# EAGLE design tomu-eagle1 (EAGLE 8.6.0)
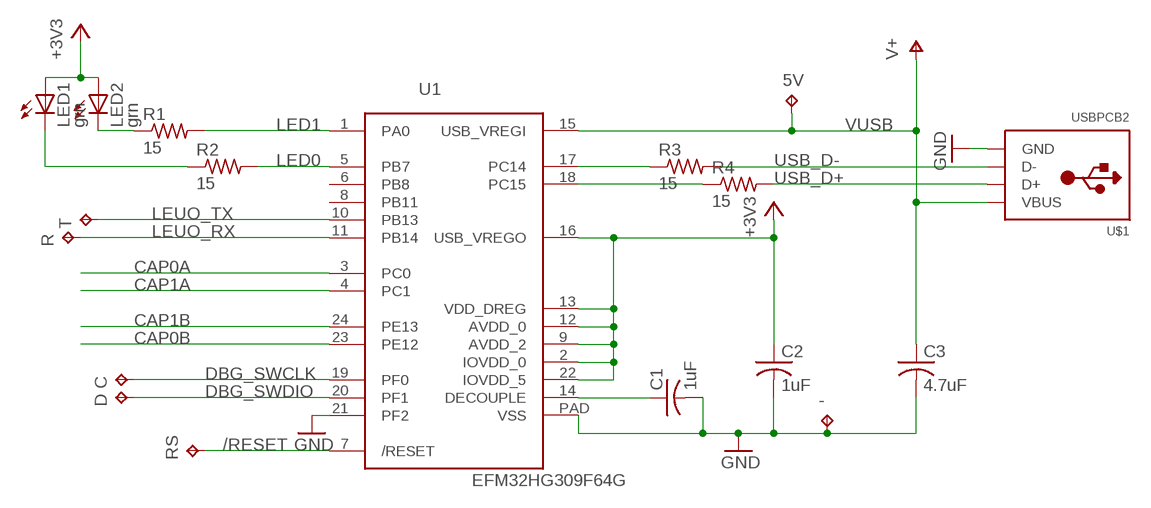
[diagram p0: schematic, sheet 1]

## Parts
5V  TPTP10R  [TP10R]
-  TPTP10SQ  [TP10SQ]
C  TPTP10R  [TP10R]
C1  1uF  C-USC0402  [C0402]
C2  1uF  C-USC0402  [C0402]
C3  4.7uF  C-USC0402  [C0402]
D  TPTP10R  [TP10R]
LED1  grn  LEDCHIP-LED0603  [CHIP-LED0603]
LED2  grn  LEDCHIP-LED0603  [CHIP-LED0603]
R  TPTP10R  [TP10R]
R1  15  R-US_R0402  [R0402]
R2  15  R-US_R0402  [R0402]
R3  15  R-US_R0402  [R0402]
R4  15  R-US_R0402  [R0402]
RS  TPTP10R  [TP10R]
T  TPTP10R  [TP10R]
U1  EFM32HG309F64G  [QFN24PAD]
U$1  USBPCB2  [USB-A-PCB-2]

## Nets
+3V3: C2.1 LED1.A LED2.A U1.2(IOVDD_0) U1.9(AVDD_2) U1.12(AVDD_0) U1.13(VDD_DREG) U1.16(USB_VREGO) U1.22(IOVDD_5)
/RESET: RS.TP U1.7(/RESET)
CAP0A: U1.3(PC0)
CAP0B: U1.23(PE12)
CAP1A: U1.4(PC1)
CAP1B: U1.24(PE13)
DBG_SWCLK: C.TP U1.19(PF0)
DBG_SWDIO: D.TP U1.20(PF1)
DECOUPLE: C1.1 U1.14(DECOUPLE)
GND: -.TP C1.2 C2.2 C3.2 U1.21(PF2) U1.PAD(VSS) U$1.GND
LED0: R2.2 U1.5(PB7)
LED1: R1.2 U1.1(PA0)
LEUO_RX: R.TP U1.11(PB14)
LEUO_TX: T.TP U1.10(PB13)
N$4: LED1.C R2.1
N$5: LED2.C R1.1
RUSB_D+: R4.1 U1.18(PC15)
RUSB_D-: R3.1 U1.17(PC14)
USB_D+: R4.2 U$1.USB_P(D+)
USB_D-: R3.2 U$1.USB_M(D-)
VUSB: 5V.TP C3.1 U1.15(USB_VREGI) U$1.5V(VBUS) ; supply symbol labelled V+
Unconnected: U1.6(PB8) U1.8(PB11)

## Library data of the parts
5V - C D R RS T = testpad:TP: Test pad
C1-C3 = adafruit:C-US: CAPACITOR, American symbol
LED1 LED2 = adafruit:LED: LED OSRAM: - CHIPLED LG R971, LG N971, LY N971, LG Q971, LY Q971, LO R971, LY R971 LH N974, LH R974 LS Q976, LO Q976, LY Q976 LO Q996 - Hyper CHIPLED LW Q18S LB Q993, LB Q99A, LB R99A - SideLED LS A670, LO A670, LY A670, LG A670, LP A670 LB A673, LV A673, LT A673, LW A673 LH A674 LY A675 LS A676, LA A676, LO A676, LY A676, LW A676 LS A679, LY A679, LG A679 - Hyper Micro SIDELED® LS Y876, LA Y876, LO Y876, LY Y876 LT Y87S - SmartLED LW L88C, LW L88S LB L89C, LB L89S, LG L890 LS L89K, LO L89K, LY L89K LS L896, LA L896, LO L896, LY L896 - TOPLED LS T670, LO T670, LY T670, LG T670, LP T670 LSG T670, LSP T670, LSY T670, LOP T670, LYG T670 LG T671, LOG T671, LSG T671 LB T673, LV T673, LT T673, LW T673 LH T674 LS T676, LA T676, LO T676, LY T676, LB T676, LH T676, LSB T676, LW T676 LB T67C, LV T67C, LT T67C, LS T67K, LO T67K, LY T67K, LW E67C LS E67B, LA E67B, LO E67B, LY E67B, LB E67C, LV E67C, LT E67C LW T67C LS T679, LY T679, LG T679 LS T770, LO T770, LY T770, LG T770, LP T770 LB T773, LV T773, LT T773, LW T773 LH T774 LS E675, LA E675, LY E675, LS T675 LS T776, LA T776, LO T776, LY T776, LB T776 LHGB T686 LT T68C, LB T68C - Hyper Mini TOPLED® LB M676 - Mini TOPLED Santana® LG M470 LS M47K, LO M47K, LY M47K Source: http://www.osram.convergy.de/
R1-R4 = adafruit:R-US_: RESISTOR, American symbol
U1 = todstuff:EFM32HG309F64G
U$1 = todstuff:USB

## Board
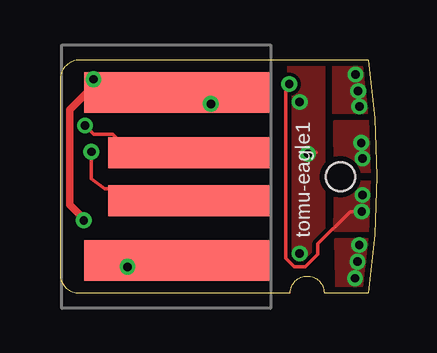
[diagram p1: board, top side]
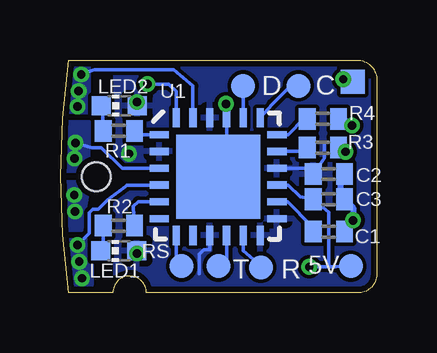
[diagram p2: board, bottom side, seen from below]

Size 13.2 x 9.7 mm. Coordinates in mm from the lower left corner, seen from the top.
Outline: 0,8.92 0,0.76 arc90 0.8,0 9.6,0 arc-180 11,0 12.85,0 arc17 12.85,9.7 0.9,9.7 arc90 0,8.92
Copper layers (1*16): Top 0.035mm / dielectric 1.5mm / Bottom 0.035mm
Design rules "SeeedStudio_2layer_DRU_no_angle_20140221": minimum track width 6mil, minimum drill 12mil, track to track 6mil, track to pad 6mil, pad to pad 6mil, via to via 6mil, smd to smd 0mil, copper to edge 10mil, drill to drill 10mil, minimum pad ring 10mil, minimum via ring 6mil, stop-mask expansion 2mil, vias tented up to drill 100mil, thermal gap 10mil
Holes 1.2 mm at 11.68,4.84

### Footprints (pad centres in the part's own frame; a part is rotated, then mirrored left to right if it is on the bottom)
TP10R = smd 1 x 1: TP 0,0
TP10SQ = smd 1 x 1: TP 0,0
C0402 = smd 0.7 x 0.9: 1 -0.65,0; 2 0.65,0
CHIP-LED0603 = smd 0.8 x 0.8: A 0,-0.75; C 0,0.75
R0402 = smd 0.7 x 0.9: 1 -0.65,0; 2 0.65,0
QFN24PAD = smd 0.8 x 0.3: 1 -2.45,1.75; 2 -2.45,1.05; 3 -2.45,0.35; 4 -2.45,-0.35; 5 -2.45,-1.05; 6 -2.45,-1.75; 13 2.45,-1.75; 14 2.45,-1.05; 15 2.45,-0.35; 16 2.45,0.35; 17 2.45,1.05; 18 2.45,1.75 | smd 0.3 x 0.8: 7 -1.75,-2.45; 8 -1.05,-2.45; 9 -0.35,-2.45; 10 0.35,-2.45; 11 1.05,-2.45; 12 1.75,-2.45; 19 1.75,2.45; 20 1.05,2.45; 21 0.35,2.45; 22 -0.35,2.45; 23 -1.05,2.45; 24 -1.75,2.45 | smd 3.5 x 3.5: PAD 0,0
USB-A-PCB-2 = smd 7.75 x 1.69: 5V -1.47,-3.5; GND -1.47,3.5 | smd 6.75 x 1.3: USB_M -0.97,-1; USB_P -0.97,1

### Placement (x,y rotation side)
5V  1.08,1.12 180 bottom
-  1,8.8 0 bottom
C  3.27,8.62 90 bottom
C1  2,2.55 0 bottom
C2  2,4.95 0 bottom
C3  2,3.9 0 bottom
D  5.57,8.62 90 bottom
LED1  10.75,1.75 90 bottom
LED2  10.73,7.8 90 bottom
R  4.83,1.06 0 bottom
R1  10.75,6.75 0 bottom
R2  10.75,2.8 0 bottom
R3  2.25,6.05 0 bottom
R4  2.25,7.25 0 bottom
RS  8.13,1.11 90 bottom
T  6.6,1.11 0 bottom
U1  6.61,4.84 0 bottom
U$1  6.35,4.84 0 top

### Tracks (layer width: path | path; a pad name or v marks a point on that pad's centre or on a via)
+3V3  (via drill 0.35)
  Top 0.152: 10.41,5.86 10.67,5.86
  Bottom 0.152: LED2.A v9.99,7.95 | LED1.A v9.99,1.64 | C2.1 2.2,5.6 2.2,6.2 | U1.16 2.79,5.19 | U1.9 6.96,1.79 7.21,1.79 7.4,1.6 7.4,1.46 7.4,0.86 7.4,0.8
  other vias: 10.33,5.8
  pour Bottom: 10.92,10.43 10.92,-1.25 0,-1.25 0,10.43
  pour Top: 10.98,10.68 9.53,10.68 9.53,-1.25 10.98,-1.25
/RESET
  Bottom 0.152: U1.7 8.36,1.42 RS.TP
CAP0A  (via drill 0.35)
  Bottom 0.152: 12.57,5.73 v12.6,5.6 | v12.55,6.25 12.29,6.17 11.88,6.05 11.47,6.05 10.61,5.19 U1.3
  pour Bottom: 11.98,7.13 13.46,7.13 13.48,5.06 12,5.05
  pour Top: 11.45,7.13 14.48,7.13 14.5,5.06 11.47,5.05
CAP0B  (via drill 0.35)
  Bottom 0.152: v12.31,9.1 11.78,9.29 8.45,9.29 7.66,8.63 U1.23
  other vias: 12.47,7.76 12.42,8.41
  pour Bottom: 11.98,10.43 11.98,7.49 13.2,7.51 12.75,10.43
  pour Top: 11.4,10.43 11.4,7.51 14.22,7.51 13.76,10.43
CAP1A  (via drill 0.35)
  Bottom 0.152: U1.4 10.4,4.49 | 10.4,4.49 10.41,4.49 | 12.35,1.79 v12.47,1.99 11.98,2.48 11.98,3.34 11.85,3.48 11.61,3.48 11.21,3.88 10.4,4.49
  other vias: 12.29,0.61 12.4,1.3
  pour Bottom: 11.83,2.22 13.25,2.21 12.67,-0.32 11.88,-0.31
  pour Top: 11.49,2.22 13.27,2.23 12.69,-0.3 11.55,-0.31
CAP1B  (via drill 0.35)
  Top 0.152: v12.57,3.39 12.09,3.39 10.74,2.04 10.74,1.6 10.22,1.08 9.76,1.08 9.4,1.44 9.4,8.55 | 9.4,8.55 9.38,8.53 | v9.55,8.7 9.4,8.55
  Bottom 0.152: U1.24 8.36,8.4 8.67,8.7 v9.55,8.7
  other vias: 12.61,4.07
  pour Bottom: 11.96,4.63 13.49,4.62 13.29,2.6 12.29,2.6
  pour Top: 11.5,4.59 13.3,4.62 13.1,2.6 11.45,2.6
DBG_SWCLK
  Bottom 0.152: C.TP 3.7,8.53 4.36,7.86 U1.19
DBG_SWDIO
  Bottom 0.152: U1.20 5.56,8.33 D.TP
DECOUPLE
  Bottom 0.152: 2.74,2.94 2.7,2.78 | 2.7,2.78 C1.1 | U1.14 3.72,3.79 2.7,2.78
GND  (via drill 0.35)
  Top 0.152: U$1.GND 7.06,8.34 v6.29,7.88 | 4.43,8.14 U$1.GND | U$1.GND 4.45,8.34 | 2.09,8.34 v1.4,8.9
  Top 0.254: 1.21,8.34 2.09,8.34 4.45,8.34 | 0.99,3.22 v0.99,3.02
  Top 0.305: v0.99,3.02 0.99,3.09 0.41,3.67 0.41,7.64 1.11,8.34 1.21,8.34
  Bottom 0.152: 6.83,4.84 U1.PAD 6.26,5.09 U1.21 6.26,7.88 v6.29,7.88 | v1.4,8.9 -.TP | C1.2 1.07,2.94 v0.99,3.02
  Bottom 0.254: C3.2 1.4,3.95 | 1.4,3.95 1.52,3.95 1.52,4.93 C2.2 | v0.99,3.02 0.99,3.54 1.4,3.95
LED0
  Bottom 0.152: R2.2 10.15,3.6 9.95,3.8 9.94,3.79 U1.5
LED1
  Bottom 0.152: U1.1 9.99,6.59 R1.2
LEUO_RX
  Bottom 0.152: U1.11 5.56,1.76 4.86,1.16 R.TP
LEUO_TX
  Bottom 0.152: U1.10 6.26,1.14 T.TP
N$4
  Bottom 0.152: R2.1 11.4,1.7 LED1.C
N$5
  Bottom 0.152: LED2.C 11.43,7.8 R1.1
RUSB_D+
  Bottom 0.152: U1.18 3.69,6.59 3.04,7.25 R4.1
RUSB_D-
  Bottom 0.152: U1.17 2.99,5.89 R3.1
USB_D+  (via drill 0.35)
  Top 0.152: U$1.USB_P 2.81,5.84 2.81,5.99 2.2,6.6 1.41,6.6 v1.04,6.97
  Bottom 0.152: R4.2 1.4,7.38 v1.04,6.97
USB_D-  (via drill 0.35)
  Top 0.152: U$1.USB_M 5.36,3.83 4.86,4.33 1.87,4.33 1.3,4.75 v1.3,5.88
  Bottom 0.152: v1.3,5.88 1.41,6.24 R3.2
VUSB  (via drill 0.35)
  Top 0.152: U$1.5V 3.36,1.34 3.12,1.21 v2.81,1.08
  Bottom 0.152: U1.15 3.69,4.49 3.2,4 C3.1 2,3.35 2,1.08 | 5V.TP 1.71,1.08 2,1.08 | 2,1.08 v2.81,1.08

### Text on the board
tPlace: tomu-eagle1